# Altium schematic sheet [14]-FPGA_Bank_7_Interface.SchDoc
size A4
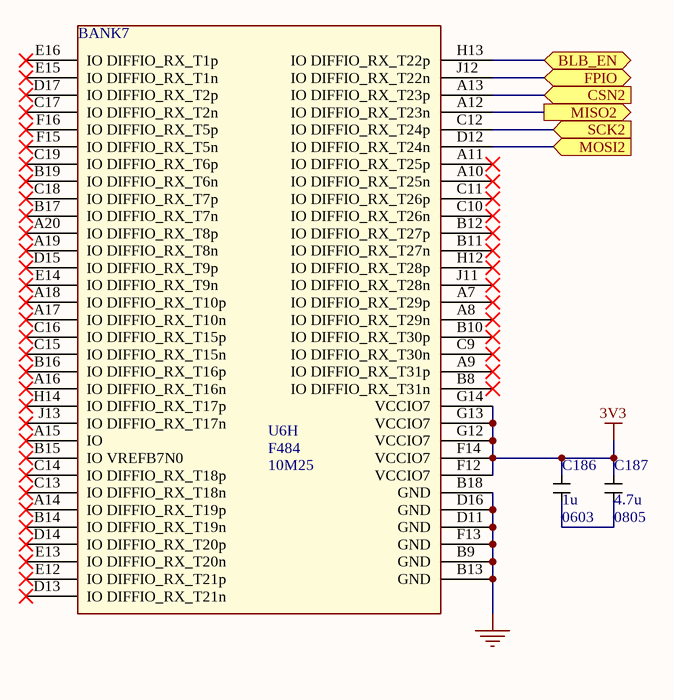
[diagram p0: [14]-FPGA_Bank_7_Interface.SchDoc]

## Parts
C186  1u  PCB Layer:: 0603  [*0603]
C187  4.7u  PCB Package: 0805  [*CAPC2013X140N]
U6  10M25  Package Type: F484  [*BGA484C100P22X22_2300X2300X200N]  (part H of 9)

## Ports
BLB_EN (bidir), CSN2 (in), FPIO (bidir), MISO2 (out), MOSI2 (in), SCK2 (in)

## Nets
3V3: C186.2 C187.2 U6.F12(VCCIO7) U6.F14(VCCIO7) U6.G12(VCCIO7) U6.G13(VCCIO7) U6.G14(VCCIO7)
GND: U6.B9(GND) U6.B13(GND) U6.B18(GND) U6.D11(GND) U6.D16(GND) U6.F13(GND)
BLB_EN: U6.H13(IO_DIFFIO_RX_T22p) ; port BLB_EN
CSN2: U6.A13(IO_DIFFIO_RX_T23p) ; port CSN2
FPIO: U6.J12(IO_DIFFIO_RX_T22n) ; port FPIO
MISO2: U6.A12(IO_DIFFIO_RX_T23n) ; port MISO2
MOSI2: U6.D12(IO_DIFFIO_RX_T24n) ; port MOSI2
SCK2: U6.C12(IO_DIFFIO_RX_T24p) ; port SCK2
NetC186_1: C186.1 C187.1

Not connected (* = marked no-connect by the designer): U6 A7(IO_DIFFIO_RX_T29p)* A8(IO_DIFFIO_RX_T29n)* A9(IO_DIFFIO_RX_T31p)* A10(IO_DIFFIO_RX_T25n)* A11(IO_DIFFIO_RX_T25p)* A14(IO_DIFFIO_RX_T19p)* A15(IO)* A16(IO_DIFFIO_RX_T16n)* A17(IO_DIFFIO_RX_T10n)* A18(IO_DIFFIO_RX_T10p)* A19(IO_DIFFIO_RX_T8n)* A20(IO_DIFFIO_RX_T8p)* B8(IO_DIFFIO_RX_T31n)* B10(IO_DIFFIO_RX_T30p)* B11(IO_DIFFIO_RX_T27n)* B12(IO_DIFFIO_RX_T27p)* B14(IO_DIFFIO_RX_T19n)* B15(IO_VREFB7N0)* B16(IO_DIFFIO_RX_T16p)* B17(IO_DIFFIO_RX_T7n)* B19(IO_DIFFIO_RX_T6n)* C9(IO_DIFFIO_RX_T30n)* C10(IO_DIFFIO_RX_T26n)* C11(IO_DIFFIO_RX_T26p)* C13(IO_DIFFIO_RX_T18n)* C14(IO_DIFFIO_RX_T18p)* C15(IO_DIFFIO_RX_T15n)* C16(IO_DIFFIO_RX_T15p)* C17(IO_DIFFIO_RX_T2n)* C18(IO_DIFFIO_RX_T7p)* C19(IO_DIFFIO_RX_T6p)* D13(IO_DIFFIO_RX_T21n)* D14(IO_DIFFIO_RX_T20p)* D15(IO_DIFFIO_RX_T9p)* D17(IO_DIFFIO_RX_T2p)* E12(IO_DIFFIO_RX_T21p)* E13(IO_DIFFIO_RX_T20n)* E14(IO_DIFFIO_RX_T9n)* E15(IO_DIFFIO_RX_T1n)* E16(IO_DIFFIO_RX_T1p)* F15(IO_DIFFIO_RX_T5n)* F16(IO_DIFFIO_RX_T5p)* H12(IO_DIFFIO_RX_T28p)* H14(IO_DIFFIO_RX_T17p)* J11(IO_DIFFIO_RX_T28n)* J13(IO_DIFFIO_RX_T17n)*

## Notes on the sheet
- (in symbol Component_1, part H) BANK7

## Library data of the parts
C186 C187 = Component_1
  C186: Buying URL:: https://uk.farnell.com/avx/0603yc105kat2a/cap-1-f-16v-10-x7r-0603/dp/1658870RL?st=1u%200603
  C187: Buying URL:: https://uk.farnell.com/avx/08053d475kat2a/cap-4-7-f-25v-10-x5r-0805/dp/1657932?st=4.7u%200805
U6 = Component_1: Part no.: 10M25DAF484I7G